# EAGLE design dot_matrix_4A_noGND (EAGLE 7.5.0)
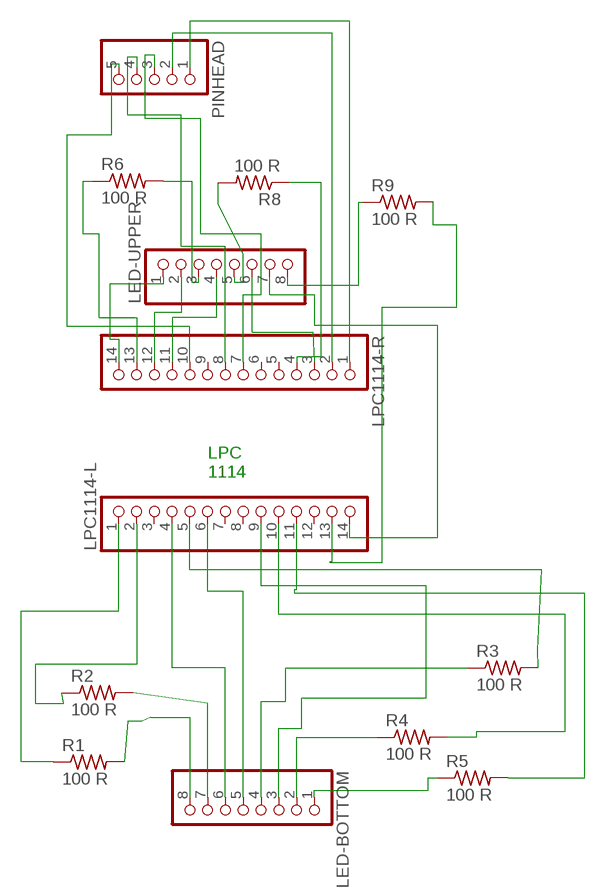
[diagram p0: schematic, sheet 1]

## Parts
LED-BOTTOM  PINHD-1X8  [1X08]
LED-UPPER  PINHD-1X8  [1X08]
LPC1114-L  PINHD-1X14  [1X14]
LPC1114-R  PINHD-1X14  [1X14]
PINHEAD  PINHD-1X5  [1X05]
R1  100 R  R-US_0204/7  [0204/7]
R2  100 R  R-US_0204/7  [0204/7]
R3  100 R  R-US_0204/7  [0204/7]
R4  100 R  R-US_0204/7  [0204/7]
R5  100 R  R-US_0204/7  [0204/7]
R6  100 R  R-US_0204/7  [0204/7]
R8  100 R  R-US_0204/7  [0204/7]
R9  100 R  R-US_0204/7  [0204/7]

## Nets
N$1: LED-UPPER.8 R9.1
N$2: LPC1114-L.1 R1.1
N$3: LPC1114-L.2 R2.1
N$4: LED-UPPER.1 LPC1114-R.14
N$5: LED-BOTTOM.8 R1.2
N$6: LED-BOTTOM.7 R2.2
N$7: LPC1114-L.11 R5.2
N$8: LED-BOTTOM.6 LPC1114-L.4
N$9: LED-BOTTOM.5 LPC1114-L.6
N$10: LPC1114-R.10 PINHEAD.5
N$11: LPC1114-R.8 PINHEAD.4
N$12: LPC1114-R.7 PINHEAD.3
N$13: LPC1114-R.2 PINHEAD.2
N$14: LED-BOTTOM.2 R4.1
N$15: LPC1114-L.10 R4.2
N$16: LED-BOTTOM.1 R5.1
N$17: LPC1114-R.1 PINHEAD.1
N$18: LED-BOTTOM.4 R3.1
N$19: LPC1114-L.5 R3.2
N$20: LED-BOTTOM.3 LPC1114-L.9
N$21: LED-UPPER.2 LPC1114-R.12
N$22: LPC1114-R.13 R6.1
N$23: LED-UPPER.4 LPC1114-R.11
N$24: LED-UPPER.5 R8.2
N$25: LPC1114-R.4 R8.1
N$26: LED-UPPER.3 R6.2
N$27: LED-UPPER.6 LPC1114-R.3
N$29: LED-UPPER.7 LPC1114-L.14
N$30: LPC1114-L.13 R9.2
Unconnected: LPC1114-L.3 LPC1114-L.7 LPC1114-L.8 LPC1114-L.12 LPC1114-R.5 LPC1114-R.6 LPC1114-R.9

## Notes on the sheet
- LPC
  1114

## Library data of the parts
LED-BOTTOM LED-UPPER = pinhead:PINHD-1X8: PIN HEADER
LPC1114-L LPC1114-R = pinhead:PINHD-1X14: PIN HEADER
PINHEAD = pinhead:PINHD-1X5: PIN HEADER
R1-R6 R8 R9 = resistor:R-US_: RESISTOR, American symbol

## Board
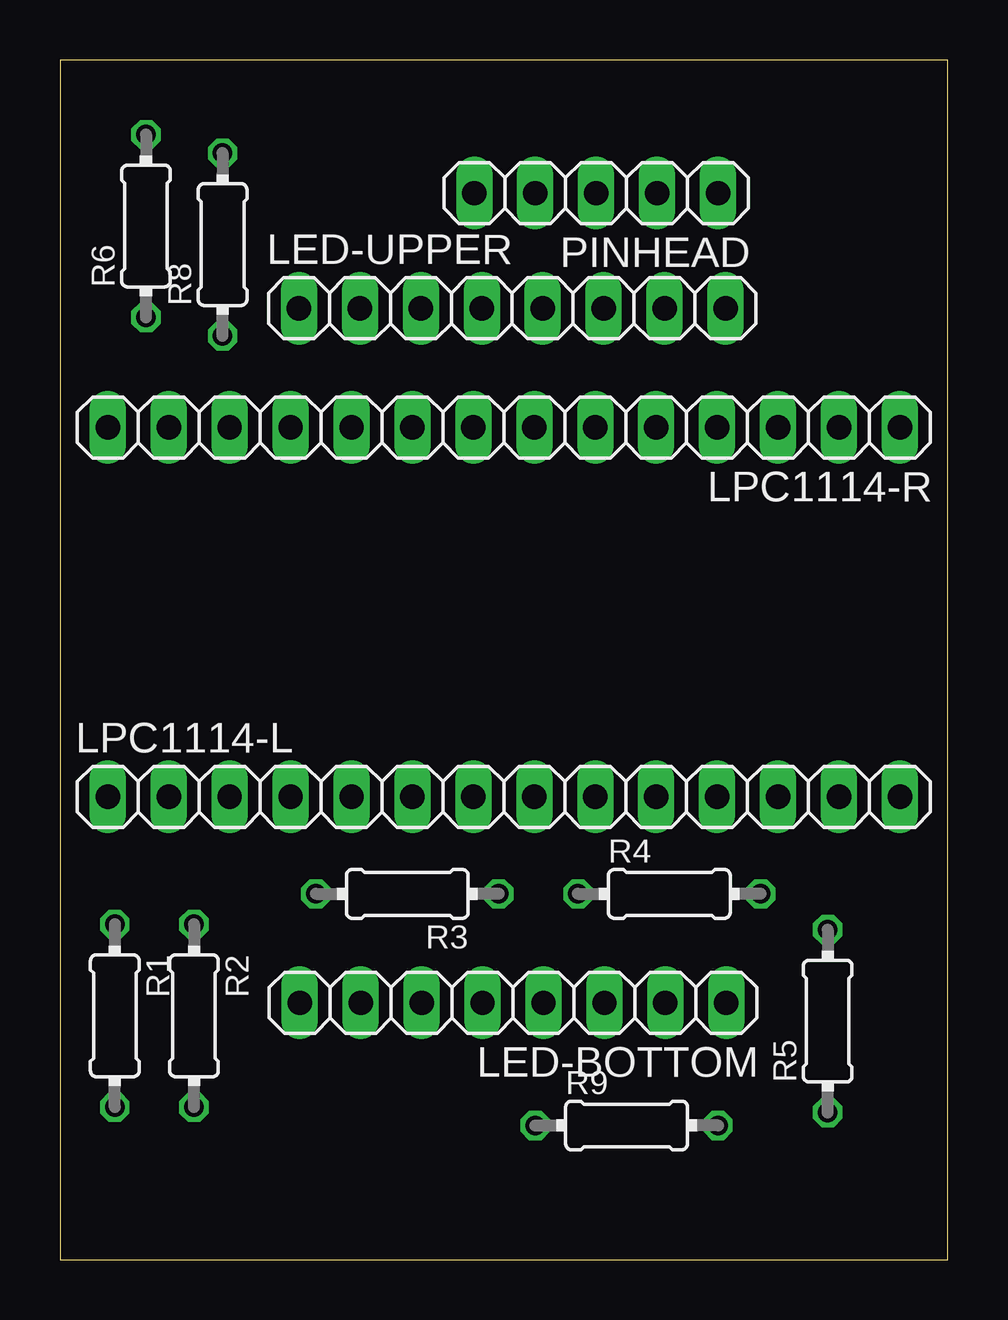
[diagram p1: board, top side]
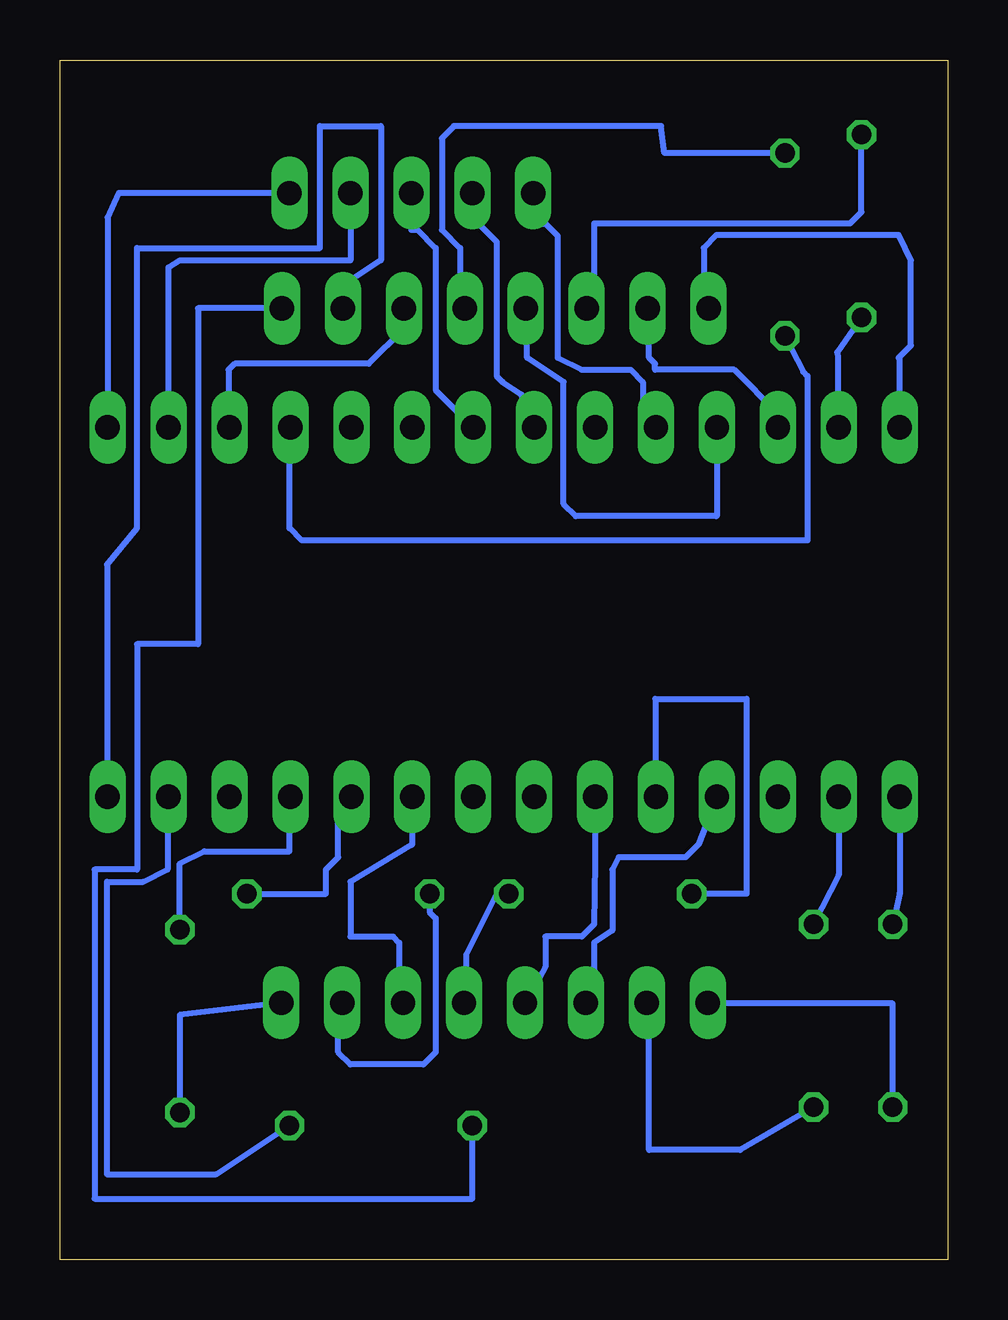
[diagram p2: board, bottom side, seen from below]

Size 37 x 50 mm. Coordinates in mm from the lower left corner, seen from the top.
Outline: 0,0 37,0 37,50 0,50 0,0
Copper layers (1*16): Top 0.035mm / dielectric 1.6mm / Bottom 0.035mm
Design rules "Elecrow_2-layer_PCB_eagle_rule": minimum track width 6mil, minimum drill 12mil, track to track 6mil, track to pad 6mil, pad to pad 6mil, via to via 8mil, smd to smd 0mil, copper to edge 20mil, drill to drill 10mil, minimum pad ring 6mil, minimum via ring 6mil, stop-mask expansion 0mil, vias tented up to drill 100mil, thermal gap 10mil

### Footprints (pad centres in the part's own frame; a part is rotated, then mirrored left to right if it is on the bottom)
1X08 = drill 1.016 long: 1 -8.89,0; 2 -6.35,0; 3 -3.81,0; 4 -1.27,0; 5 1.27,0; 6 3.81,0; 7 6.35,0; 8 8.89,0
1X14 = drill 1.016 long: 1 -16.51,0; 2 -13.97,0; 3 -11.43,0; 4 -8.89,0; 5 -6.35,0; 6 -3.81,0; 7 -1.27,0; 8 1.27,0; 9 3.81,0; 10 6.35,0; 11 8.89,0; 12 11.43,0; 13 13.97,0; 14 16.51,0
1X05 = drill 1.016 long: 1 -5.08,0; 2 -2.54,0; 3 0,0; 4 2.54,0; 5 5.08,0
0204/7 = drill 0.813 octagon: 1 -3.81,0; 2 3.81,0

### Placement (x,y rotation side)
LED-BOTTOM  18.89,10.7 180 top
LED-UPPER  18.85,39.65 0 top
LPC1114-L  18.5,19.29 0 top
LPC1114-R  18.5,34.68 180 top
PINHEAD  22.35,44.45 180 top
R1  2.29,10.16 270 top
R2  5.59,10.16 270 top
R3  14.48,15.24 180 top
R4  25.4,15.24 0 top
R5  32,9.94 90 top
R6  3.59,43.08 90 top
R8  6.78,42.31 90 top
R9  23.62,5.59 0 top

### Tracks (layer width: path | path; a pad name or v marks a point on that pad's centre or on a via)
N$1
  Bottom 0.254: LED-UPPER.8 31.24,39.65 31.24,25.65 33.78,25.65 33.78,16.26 35.56,16.26 35.56,2.54 19.81,2.54 R9.1
N$2
  Bottom 0.254: LPC1114-L.1 1.99,15.28 R1.1
N$3
  Bottom 0.254: LPC1114-L.2 4.53,16.04 R2.1
N$4
  Bottom 0.254: LED-UPPER.1 10.16,39.85 10.16,42.16 9.63,42.7 2.03,42.7 1.52,41.66 1.52,38.1 2.03,37.59 1.99,37.55 LPC1114-R.14
N$5
  Bottom 0.254: 9.91,10.61 9.96,10.67 | R1.2 2.29,10.67 9.96,10.67 | 9.96,10.67 LED-BOTTOM.8
N$6
  Bottom 0.254: R2.2 8.64,4.57 12.45,4.57 12.45,10.61 LED-BOTTOM.7
N$7
  Bottom 0.254: R5.2 32,16.51 30.99,17.02 27.43,17.02 27.43,19.25 LPC1114-L.11
N$8
  Bottom 0.254: LPC1114-L.4 10.38,17.31 10.92,16.76 13.72,16.76 13.97,16.26 13.97,13.72 14.73,13.21 14.73,11.04 LED-BOTTOM.6
N$9
  Bottom 0.254: LPC1114-L.6 14.69,16.55 14.73,13.97 15.24,13.46 16.76,13.46 16.76,12.19 17.53,10.79 LED-BOTTOM.5
N$10
  Bottom 0.254: PINHEAD.5 17.27,43.18 16.76,43.18 16.26,42.67 16.26,37.59 15.24,37.08 13.21,37.08 12.7,36.58 12.7,35.23 LPC1114-R.10
N$11
  Bottom 0.254: PINHEAD.4 19.81,43.18 19.56,43.18 18.8,42.42 18.8,36.83 18.54,36.58 17.78,36.07 17.27,34.72 LPC1114-R.8
N$12
  Bottom 0.254: PINHEAD.3 22.35,42.93 22.1,42.93 21.34,42.16 21.34,36.25 LPC1114-R.7
N$13
  Bottom 0.254: PINHEAD.2 24.89,41.66 32,41.66 32.47,41.36 LPC1114-R.2
N$14
  Bottom 0.254: R4.1 21.59,14.48 21.34,14.22 21.34,8.64 21.84,8.13 24.89,8.13 25.4,8.64 25.4,10.54 LED-BOTTOM.2
N$15
  Bottom 0.254: R4.2 25.91,15.24 25.91,16.26 25.4,16.76 25.4,18.74 LPC1114-L.10 24.89,19.25
N$16
  Bottom 0.254: LED-BOTTOM.1 32,10.19 R5.1
N$17
  Bottom 0.254: PINHEAD.1 34.54,44.45 35.01,43.43 LPC1114-R.1
N$18
  Bottom 0.254: R3.1 18.8,15.24 20.07,12.7 20.07,10.79 LED-BOTTOM.4
N$19
  Bottom 0.254: LPC1114-L.5 12.15,23.33 12.19,23.37 8.38,23.37 8.38,15.24 R3.2
N$20
  Bottom 0.254: LPC1114-L.9 22.31,17.31 22.35,17.27 24.89,15.75 24.89,13.46 23.11,13.46 22.86,13.21 22.86,10.86 LED-BOTTOM.3
N$21
  Bottom 0.254: LPC1114-R.12 7.07,35.27 8.89,37.08 12.19,37.08 12.19,37.34 12.45,37.59 12.45,39.59 LED-UPPER.2
N$22
  Bottom 0.254: R6.1 4.6,37.82 4.57,37.59 4.57,34.72 LPC1114-R.13
N$23
  Bottom 0.254: LPC1114-R.11 9.61,31.03 9.65,30.99 15.49,30.99 16,31.5 16,36.58 17.53,37.59 17.53,39.59 LED-UPPER.4
N$24
  Bottom 0.254: R8.2 11.79,46.12 11.94,47.24 20.57,47.24 21.08,46.74 21.08,42.93 20.32,42.16 20.32,39.85 LED-UPPER.5
N$25
  Bottom 0.254: R8.1 6.02,37 5.84,36.83 5.84,29.97 26.92,29.97 27.43,30.48 27.43,34.65 LPC1114-R.4
N$26
  Bottom 0.254: LED-UPPER.3 14.73,39.96 14.73,43.18 4.06,43.18 3.59,43.66 R6.2
N$27
  Bottom 0.254: LED-UPPER.6 22.66,38.8 24.13,37.34 29.72,37.34 29.97,37.08 29.97,34.72 LPC1114-R.3
N$29
  Bottom 0.254: LPC1114-L.14 35.01,28.92 35.05,28.96 33.78,30.48 33.78,42.16 26.16,42.16 26.16,47.24 23.62,47.24 23.62,41.66 25.15,40.64 25.15,39.71 LED-UPPER.7
N$30
  Bottom 0.254: LPC1114-L.13 32.51,19.29 32.51,16.26 33.53,15.75 35.05,15.75 35.05,3.56 30.48,3.56 R9.2